# Altium schematic sheet MCU.SchDoc: MCU
size 420 x 297 mm; DrawnBy: Hung Vo; SheetNumber: 2; SheetTotal: 6; MasterProject: BTL TKHTN
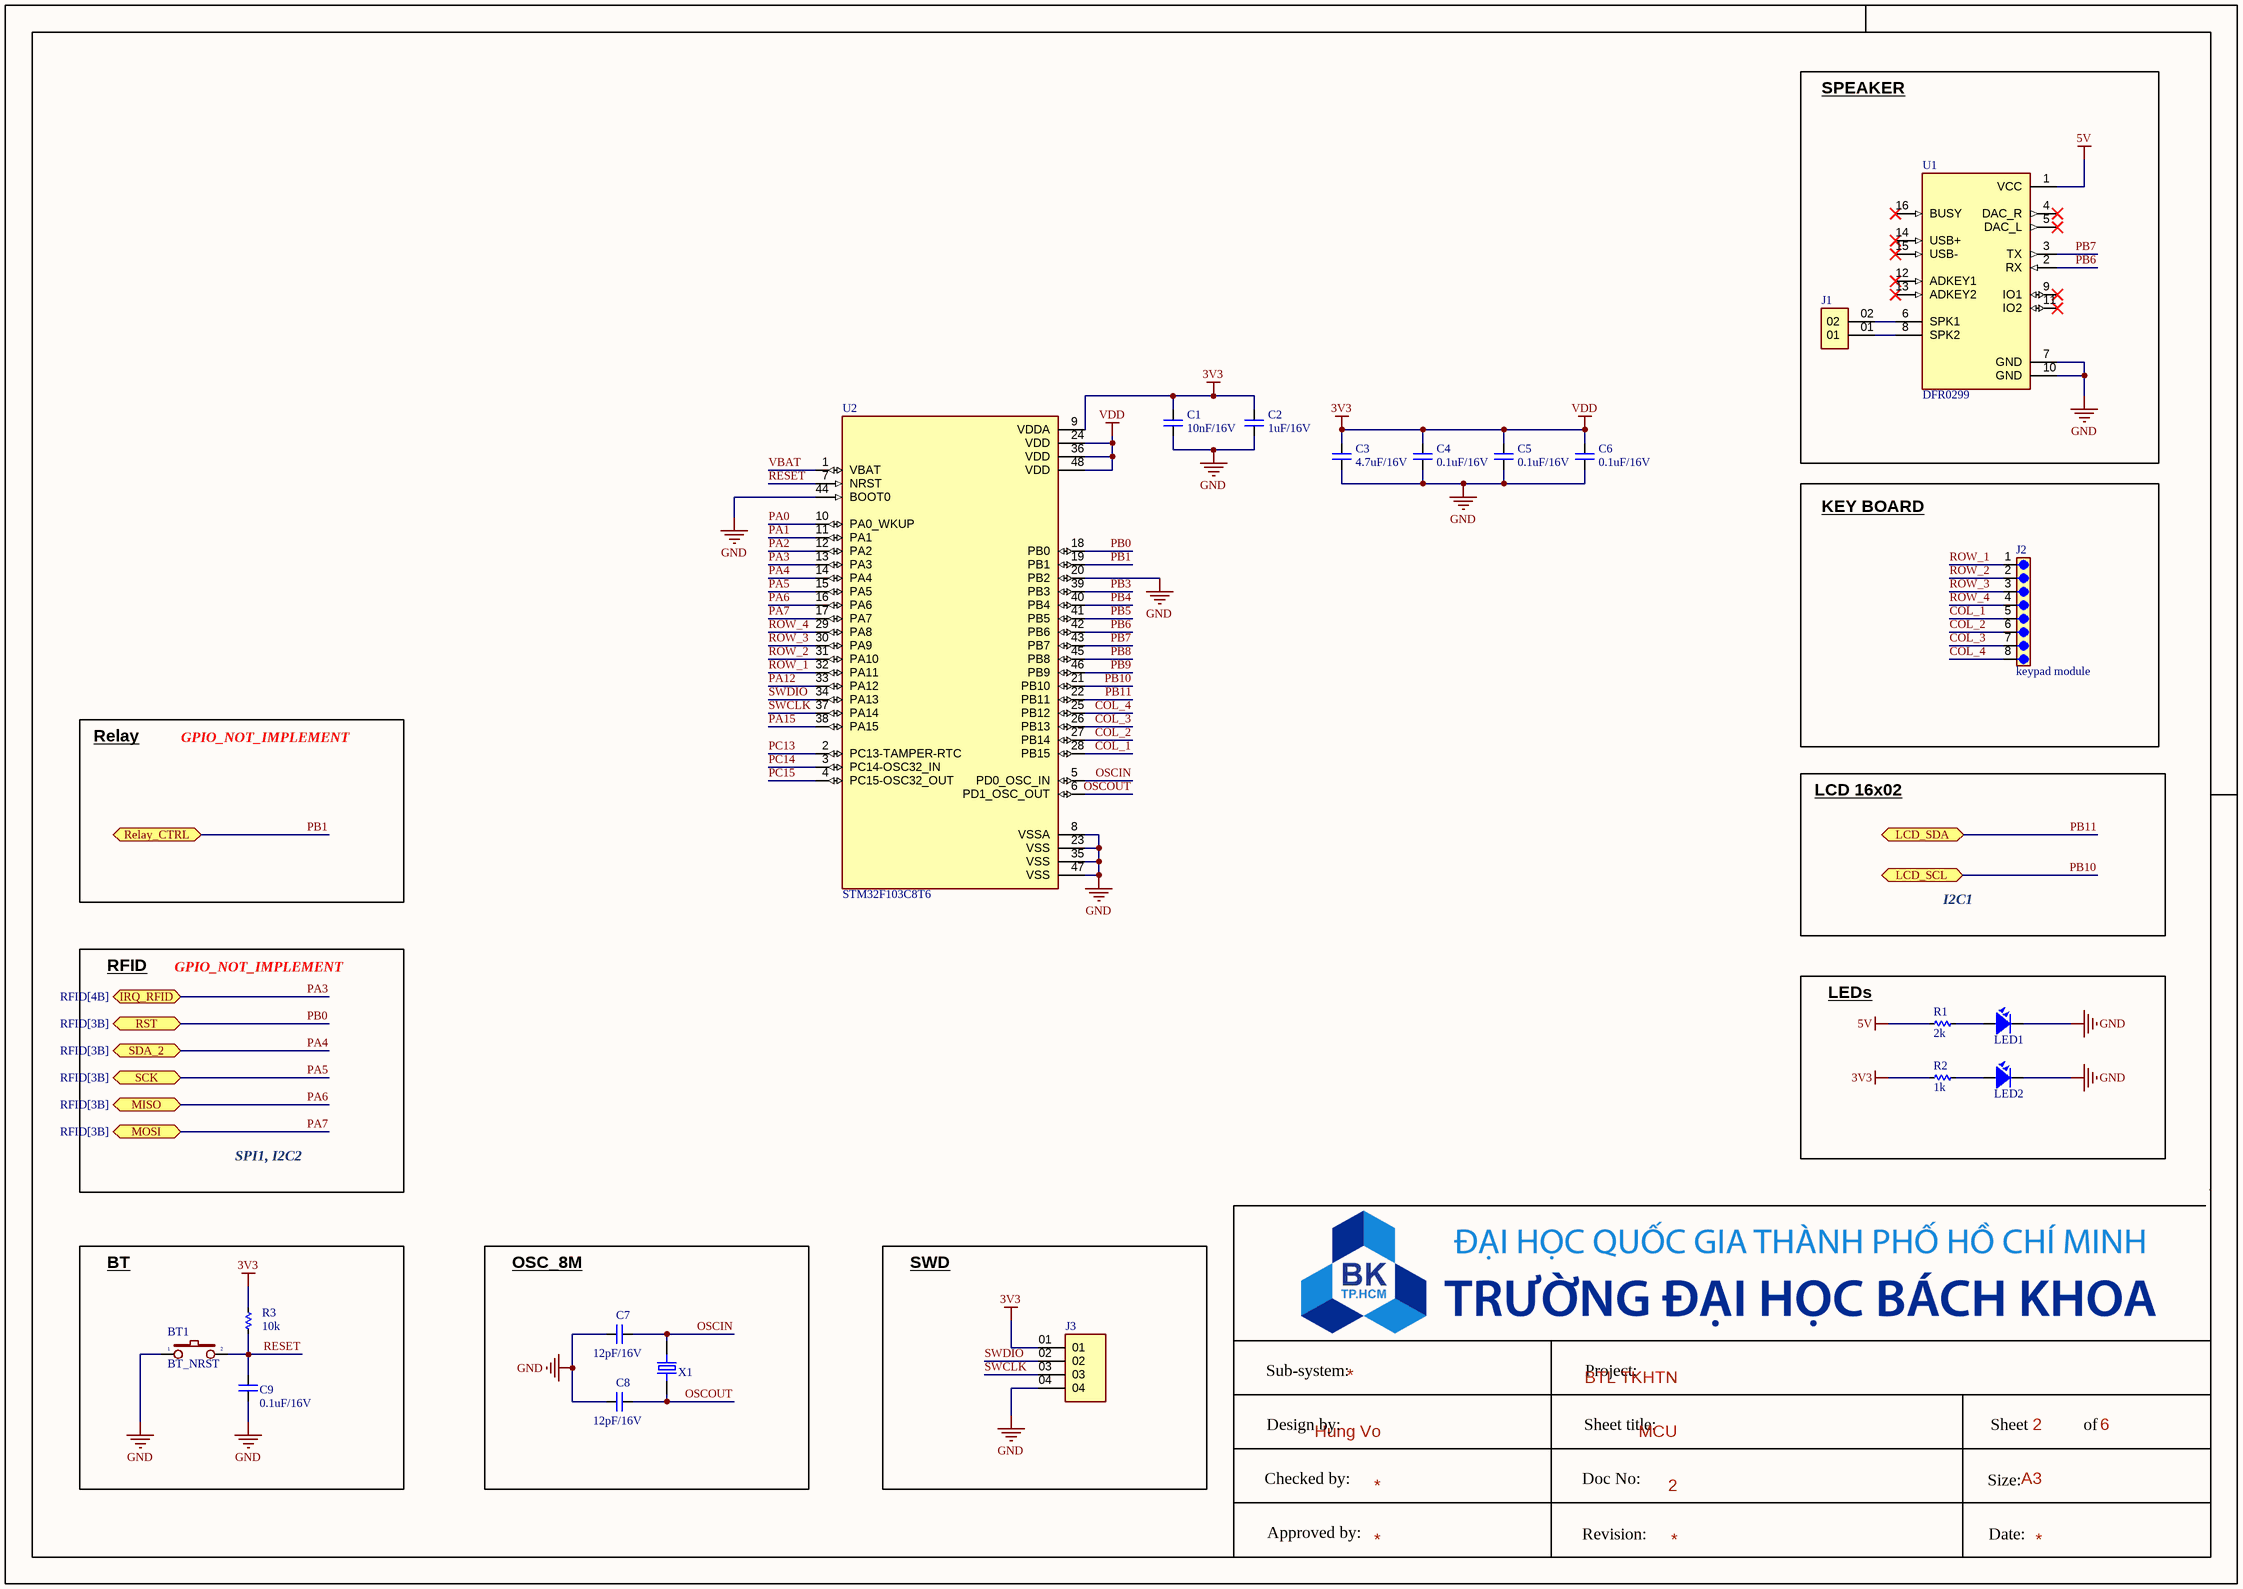
[diagram p0: MCU.SchDoc]

## Parts
BT1  BT_NRST  [SW2-SMD]
C1  10nF/16V  [CAP_C_1608X80]
C2  1uF/16V  [CAP_C_1608X80]
C3  4.7uF/16V  [CAP_C_1608X80]
C4  0.1uF/16V  [CAP_C_1608X80]
C5  0.1uF/16V  [CAP_C_1608X80]
C6  0.1uF/16V  [CAP_C_1608X80]
C7  12pF/16V  [CAP_C_1608X80]
C8  12pF/16V  [CAP_C_1608X80]
C9  0.1uF/16V  [CAP_C_1608X80]
J1  MTSW-102-08-G-S-100-RA  [SAMTEC_MTSW-102-08-G-S-100-RA]  (value not drawn)
J2  keypad module  [61300811121]
J3  HTSW-104-08-G-S-RA  [SAMTEC_HTSW-104-08-G-S-RA]  (value not drawn)
LED1  LED  [LED-0603-RED]  (value not drawn)
LED2  LED  [LED-0603-RED]  (value not drawn)
R1  2k  [RES_C_1608X60]
R2  1k  [RES_C_1608X60]
R3  10k  [RES_C_1608X60]
U1  DFR0299  [MODULE_DFR0299]
U2  STM32F103C8T6  [QFP50P900X900X160-48N]
X1  ECS-080-18-5PX-JES-TR  [XTAL 8MHz]  (value not drawn)

## Blocks framed on the sheet
SPEAKER: J1 U1
KEY BOARD: J2
LEDs: LED1 LED2 R1 R2
BT: BT1 C9 R3
OSC_8M: C7 C8 X1
SWD: J3

## Ports
IRQ_RFID (bidir, see RFID[4B]), LCD_SCL (bidir, see LCD[4B]), LCD_SDA (bidir, see LCD[4B]), MISO (bidir, see RFID[3B]), MOSI (bidir, see RFID[3B]), Relay_CTRL (bidir, see Relay[2B]), RST (bidir, see RFID[3B]), SCK (bidir, see RFID[3B]), SDA_2 (bidir, see RFID[3B])

## Nets
3V3: C1.2 C2.2 C3.2 C4.2 C5.2 C6.2 J3.01 R2.2 R3.2 U2.9(VDDA) U2.24(VDD) U2.36(VDD) U2.48(VDD)  [also labelled VDD]
5V: R1.2 U1.1(VCC)
GND: BT1.1 C1.1 C2.1 C3.1 C4.1 C5.1 C6.1 C7.1 C8.1 C9.1 J3.04 LED1.2 LED2.2 U1.7(GND) U1.10(GND) U2.8(VSSA) U2.20(PB2) U2.23(VSS) U2.35(VSS) U2.44(BOOT0) U2.47(VSS)
COL_1: J2.5 U2.28(PB15)
COL_2: J2.6 U2.27(PB14)
COL_3: J2.7 U2.26(PB13)
COL_4: J2.8 U2.25(PB12)
OSCIN: C7.2 U2.5(PD0_OSC_IN) X1.1
OSCOUT: C8.2 U2.6(PD1_OSC_OUT) X1.2
PA0: U2.10(PA0_WKUP)
PA1: U2.11(PA1)
PA2: U2.12(PA2)
PA3: U2.13(PA3) ; port IRQ_RFID
PA4: U2.14(PA4) ; port SDA_2
PA5: U2.15(PA5) ; port SCK
PA6: U2.16(PA6) ; port MISO
PA7: U2.17(PA7) ; port MOSI
PA12: U2.33(PA12)
PA15: U2.38(PA15)
PB0: U2.18(PB0) ; port RST
PB1: U2.19(PB1) ; port Relay_CTRL
PB3: U2.39(PB3)
PB4: U2.40(PB4)
PB5: U2.41(PB5)
PB6: U1.2(RX) U2.42(PB6)
PB7: U1.3(TX) U2.43(PB7)
PB8: U2.45(PB8)
PB9: U2.46(PB9)
PB10: U2.21(PB10) ; port LCD_SCL
PB11: U2.22(PB11) ; port LCD_SDA
PC13: U2.2(PC13-TAMPER-RTC)
PC14: U2.3(PC14-OSC32_IN)
PC15: U2.4(PC15-OSC32_OUT)
RESET: BT1.2 C9.2 R3.1 U2.7(NRST)
ROW_1: J2.1 U2.32(PA11)
ROW_2: J2.2 U2.31(PA10)
ROW_3: J2.3 U2.30(PA9)
ROW_4: J2.4 U2.29(PA8)
SWCLK: J3.03 U2.37(PA14)
SWDIO: J3.02 U2.34(PA13)
VBAT: U2.1(VBAT)
NetJ1_01: J1.01 U1.8(SPK2)
NetJ1_02: J1.02 U1.6(SPK1)
NetLED1_1: LED1.1 R1.1
NetLED2_1: LED2.1 R2.1

Not connected (* = marked no-connect by the designer): U1 4(DAC_R)* 5(DAC_L)* 9(IO1)* 11(IO2)* 12(ADKEY1)* 13(ADKEY2)* 14(USB+)* 15(USB-)* 16(BUSY)*

## Notes on the sheet
- Relay
- GPIO_NOT_IMPLEMENT
- LCD 16x02
- I2C1
- RFID
- SPI1, I2C2
- Sub-system:
- Project:
- Design by:
- Sheet title:
- Sheet
- of
- Checked by:
- Approved by:
- Doc No:
- Revision:
- Size:
- Date:
- A3

## Library data of the parts
BT1 = BT2: Switch button 2 pin; Value: SW chip 2 pin
C1-C9 = CAP_SMD: CAP_Chip; Value: 33pF
J1 = MTSW-102-08-G-S-100-RA: Connector Header Through Hole, Right Angle 2 position 0.100 (2.54mm); MF: Samtec; SnapEDA_Link: https://www.snapeda.com/parts/MTSW-102-08-G-S-100-RA/Samtec/view-part/?ref=snap; Package: None; Value: *; MP: MTSW-102-08-G-S-100-RA; Check_prices: https://www.snapeda.com/parts/MTSW-102-08-G-S-100-RA/Samtec/view-part/?ref=eda
J2 = keypad module: 8 pins, 1 row, straight, gold plating; MF: Wurth Electronics; SnapEDA_Link: https://www.snapeda.com/parts/61300811121/Wurth+Electronics/view-part/?ref=snap; Package: None; Value: *; MP: 61300811121; Check_prices: https://www.snapeda.com/parts/61300811121/Wurth+Electronics/view-part/?ref=eda
J3 = HTSW-104-08-G-S-RA: MF: Samtec; MP: HTSW-104-08-G-S-RA; Package: None; Availability: Unavailable; Value: *; Price: None
LED1 LED2 = LED SMD: Value: LED 3 - 5 ly 2 Colour
R1-R3 = RES_SMD: RES
U1 = DFR0299: - MP3 Player Audio Arduino Platform Evaluation Expansion Board; MF: DFRobot; SnapEDA_Link: https://www.snapeda.com/parts/DFR0299/DFRobot/view-part/?ref=snap; Package: None; Value: *; MP: DFR0299; Check_prices: https://www.snapeda.com/parts/DFR0299/DFRobot/view-part/?ref=eda
U2 = STM32F103C8T6: ARM® Cortex®-M3 STM32F1 Microcontroller IC 32-Bit 72MHz 64KB (64K x 8) FLASH 48-LQFP (7x7); MF: STMicroelectronics; SnapEDA_Link: https://www.snapeda.com/parts/STM32F103C8T6/STMicroelectronics/view-part/?ref=snap; Package: LQFP-48 STMicroelectronics; Value: *; MP: STM32F103C8T6; Check_prices: https://www.snapeda.com/parts/STM32F103C8T6/STMicroelectronics/view-part/?ref=eda
X1 = ECS-080-18-5PX-JES-TR: 8 MHz Â±20ppm Crystal 18pF 60 Ohms HC-49/US; MF: ECS Inc.; SnapEDA_Link: https://www.snapeda.com/parts/ECS-080-18-5PX-JES-TR/ECS/view-part/?ref=snap; Package: CSM-7X-3L-5G3X-2 ECS; Value: *; MP: ECS-080-18-5PX-JES-TR; Check_prices: https://www.snapeda.com/parts/ECS-080-18-5PX-JES-TR/ECS/view-part/?ref=eda